# Altium schematic sheet cn0383.SchDoc
size A3
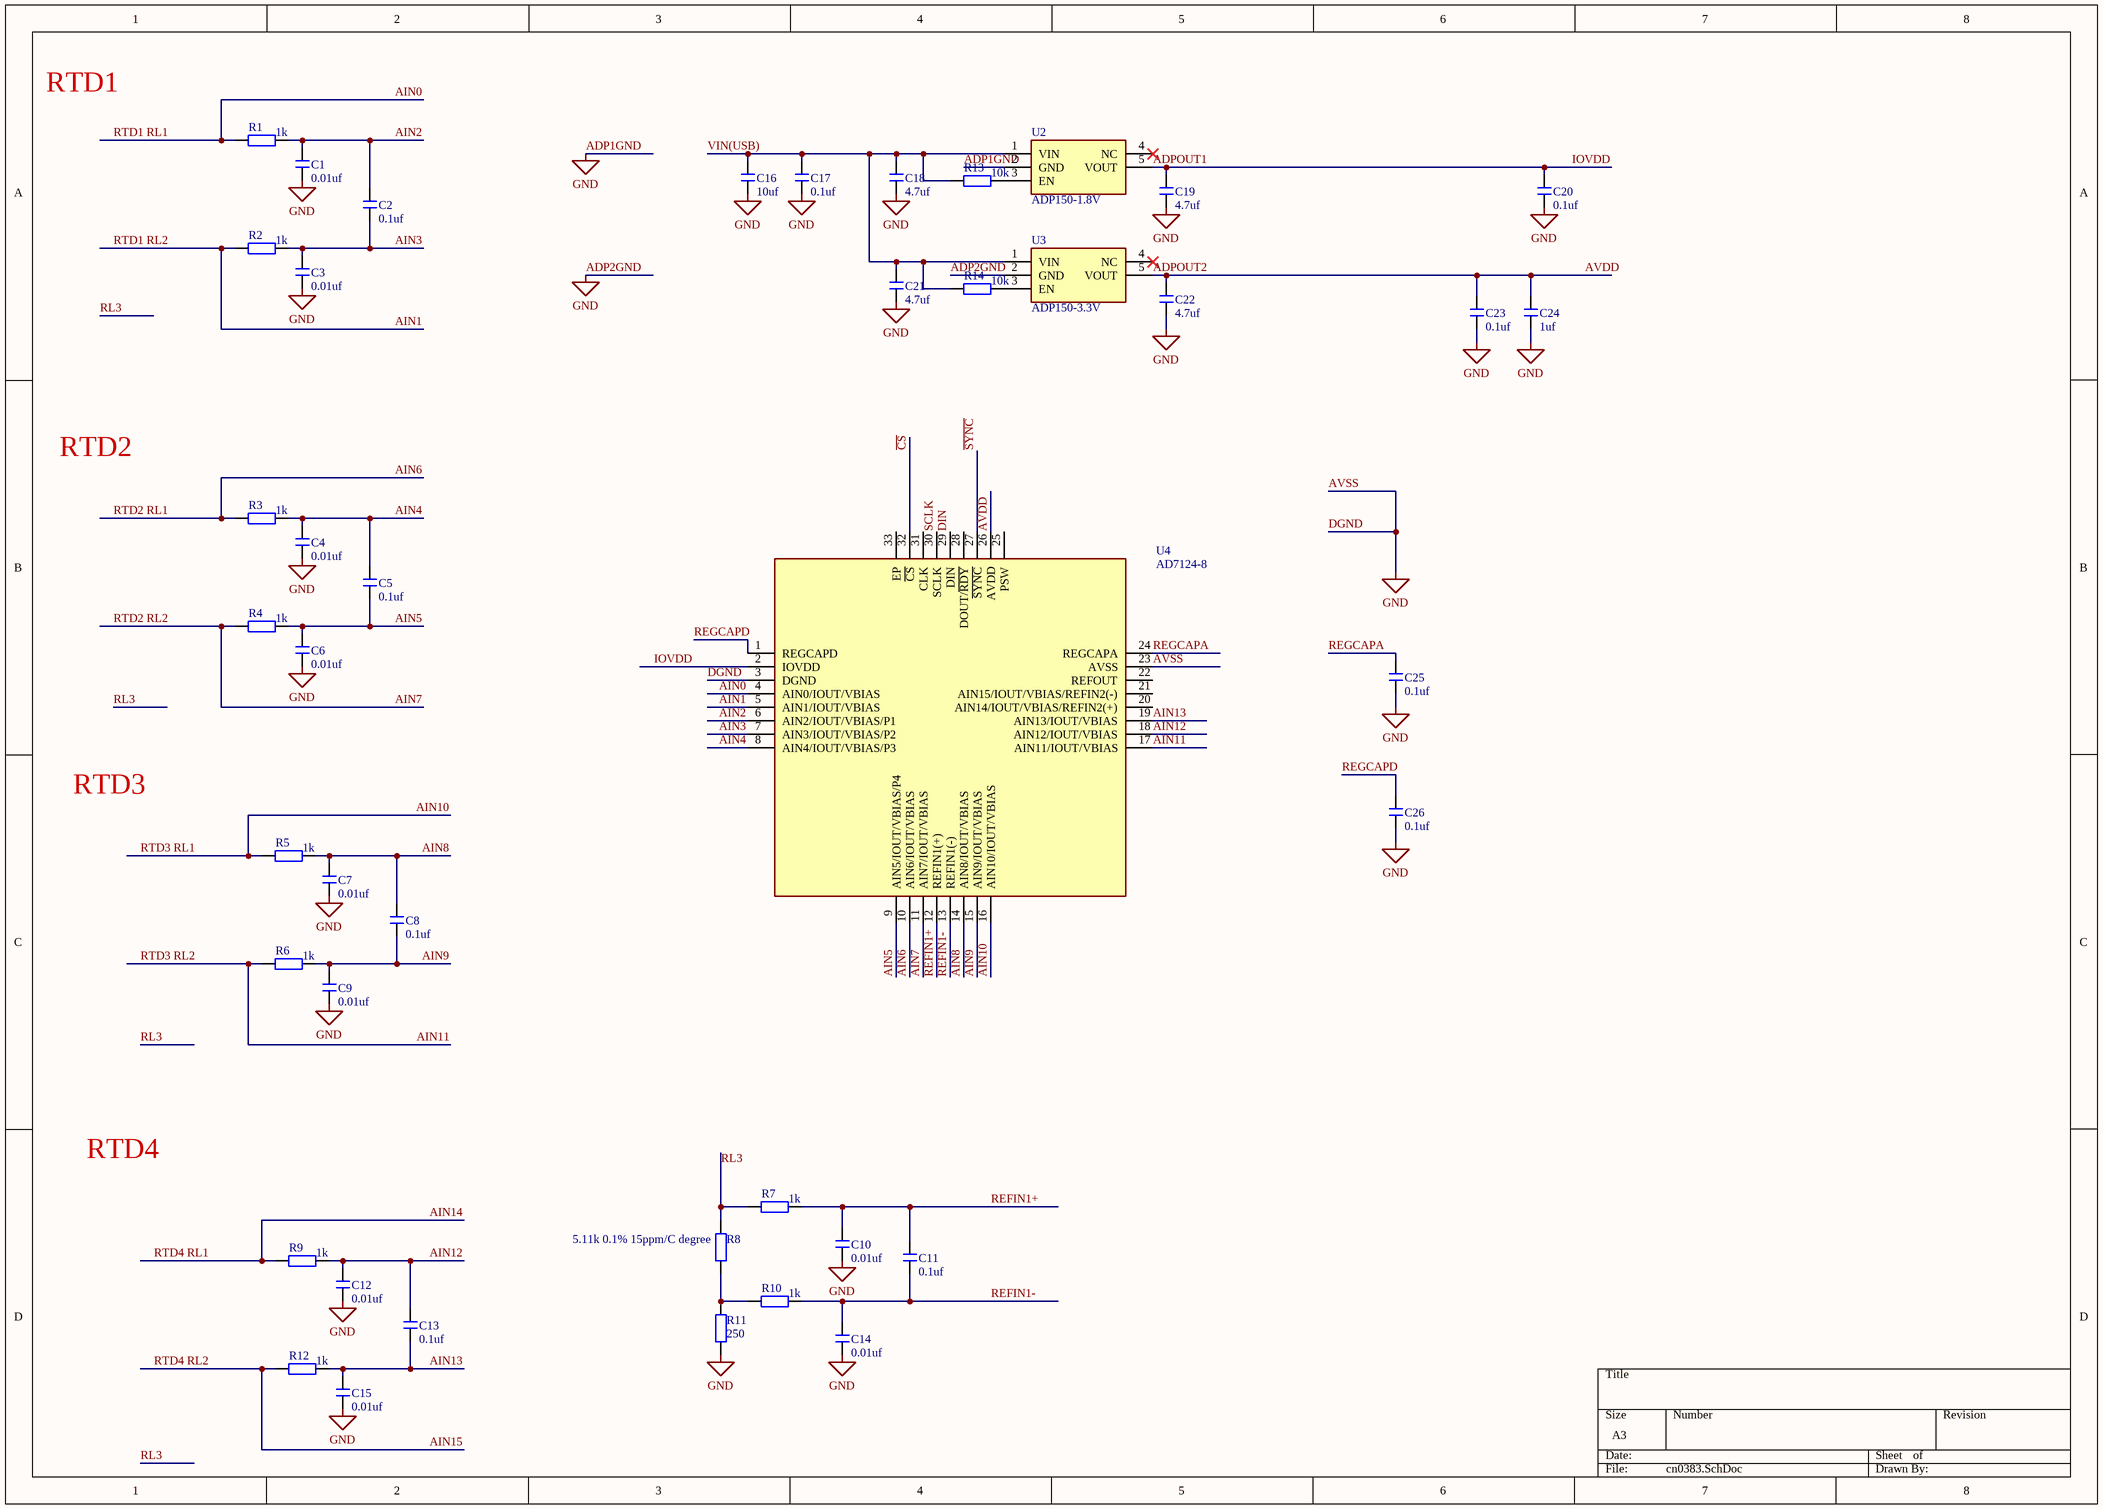
[diagram p0: cn0383.SchDoc]

## Parts
C1  0.01uf  [C 0805_L]
C2  0.1uf  [C 0805_L]
C3  0.01uf  [C 0805_L]
C4  0.01uf  [C 0805_L]
C5  0.1uf  [C 0805_L]
C6  0.01uf  [C 0805_L]
C7  0.01uf  [C 0805_L]
C8  0.1uf  [C 0805_L]
C9  0.01uf  [C 0805_L]
C10  0.01uf  [C 0805_L]
C11  0.1uf  [C 0805_L]
C12  0.01uf  [C 0805_L]
C13  0.1uf  [C 0805_L]
C14  0.01uf  [C 0805_L]
C15  0.01uf  [C 0805_L]
C16  10uf  [C 0805_L]
C17  0.1uf  [C 0805_L]
C18  4.7uf  [C 0805_L]
C19  4.7uf  [C 0805_L]
C20  0.1uf  [C 0805_L]
C21  4.7uf  [C 0805_L]
C22  4.7uf  [C 0805_L]
C23  0.1uf  [C 0805_L]
C24  1uf  [C 0805_L]
C25  0.1uf  [C 0805_L]
C26  0.1uf  [C 0805_L]
R1  1k  [0805_R]
R2  1k  [0805_R]
R3  1k  [0805_R]
R4  1k  [0805_R]
R5  1k  [0805_R]
R6  1k  [0805_R]
R7  1k  [0805_R]
R8  5.11k 0.1% 15ppm/C degree  [0805_R]
R9  1k  [0805_R]
R10  1k  [0805_R]
R11  250  [0805_R]
R12  1k  [0805_R]
R13  10k  [0805_R]
R14  10k  [0805_R]
U2  ADP150-1.8V
U3  ADP150-3.3V
U4  AD7124-8

## Nets
ADP1GND: C1.1 C3.1 C4.1 C6.1 C7.1 C9.1 C10.1 C12.1 C14.1 C15.1 C16.1 C17.1 C18.1 C19.1 C20.1 C21.1 C22.1 C23.1 C24.1 C25.1 C26.1 R11.1 U2.2(GND) U3.2(GND) U4.3(DGND) U4.23(AVSS)  [also labelled ADP2GND, AVSS, DGND, GND]
ADPOUT1: C19.2 C20.2 U2.5(VOUT) U4.2(IOVDD)  [also labelled IOVDD]
ADPOUT2: C22.2 C23.2 C24.2 U3.5(VOUT) U4.26(AVDD)  [also labelled AVDD]
AIN0: R1.1 U4.4(AIN0/IOUT/VBIAS)  [also labelled RTD1 RL1]
AIN1: R2.1 U4.5(AIN1/IOUT/VBIAS)  [also labelled RTD1 RL2]
AIN2: C1.2 C2.2 R1.2 U4.6(AIN2/IOUT/VBIAS/P1)
AIN3: C2.1 C3.2 R2.2 U4.7(AIN3/IOUT/VBIAS/P2)
AIN4: C4.2 C5.2 R3.2 U4.8(AIN4/IOUT/VBIAS/P3)
AIN5: C5.1 C6.2 R4.2 U4.9(AIN5/IOUT/VBIAS/P4)
AIN6: R3.1 U4.10(AIN6/IOUT/VBIAS)  [also labelled RTD2 RL1]
AIN7: R4.1 U4.11(AIN7/IOUT/VBIAS)  [also labelled RTD2 RL2]
AIN8: C7.2 C8.2 R5.2 U4.14(AIN8/IOUT/VBIAS)
AIN9: C8.1 C9.2 R6.2 U4.15(AIN9/IOUT/VBIAS)
AIN10: R5.1 U4.16(AIN10/IOUT/VBIAS)  [also labelled RTD3 RL1]
AIN11: R6.1 U4.17(AIN11/IOUT/VBIAS)  [also labelled RTD3 RL2]
AIN12: C12.2 C13.2 R9.2 U4.18(AIN12/IOUT/VBIAS)
AIN13: C13.1 C15.2 R12.2 U4.19(AIN13/IOUT/VBIAS)
AIN14: R9.1  [also labelled RTD4 RL1]
AIN15: R12.1  [also labelled RTD4 RL2]
~{CS}: U4.32(~{CS})
DIN: U4.29(DIN)
REFIN1+: C10.2 C11.2 R7.2 U4.12(REFIN1(+))
REFIN1-: C11.1 C14.2 R10.2 U4.13(REFIN1(-))
REGCAPA: C25.2 U4.24(REGCAPA)
REGCAPD: C26.2 U4.1(REGCAPD)
RL3: R7.1 R8.2
~{SYNC}: U4.27(~{SYNC})
SCLK: U4.30(SCLK)
VIN(USB): C16.2 C17.2 C18.2 C21.2 R13.1 R14.1 U2.1(VIN) U3.1(VIN)
NetR8_1: R8.1 R10.1 R11.2
NetR13_2: R13.2 U2.3(EN)
NetR14_2: R14.2 U3.3(EN)

Not connected (* = marked no-connect by the designer): U2 4(NC)*; U3 4(NC)*; U4 20(AIN14/IOUT/VBIAS/REFIN2(+)) 21(AIN15/IOUT/VBIAS/REFIN2(-)) 22(REFOUT) 25(PSW) 28(DOUT/~{RDY}) 31(CLK) 33(EP)

## Notes on the sheet
- RTD1
- RTD2
- RTD3
- RTD4

## Library data of the parts
C1-C26 = C: 贴片电容; BOM名称: 无极性贴片电容; 淘宝ID: 封装库来自淘宝 ID：黄晶宝石; 联系售后，技术支持: https://shop463601444.taobao.com; 唯一出售店铺网址: https://shop463601444.taobao.com
R1-R10 R12-R14 = 0805 电阻: 贴片电阻 0805 电阻; ComponentLink1Description: 供应商链接; ComponentLink1URL: http://www.szlcsc.com/product/details_18165.html; Package: 0805; Supplier: LC; SuppliersPartNumber: C17477
R11 = 0805 电阻: Reference buffer Headroom 贴片电阻 0805 电阻; ComponentLink1Description: 供应商链接; ComponentLink1URL: http://www.szlcsc.com/product/details_18165.html; Package: 0805; Supplier: LC; SuppliersPartNumber: C17477
U2 = ADP150: IOVDD needs 1.8V
U3 = ADP150: ACDD needs 3.3V